# Altium schematic sheet DRIVER.SchDoc
size A4
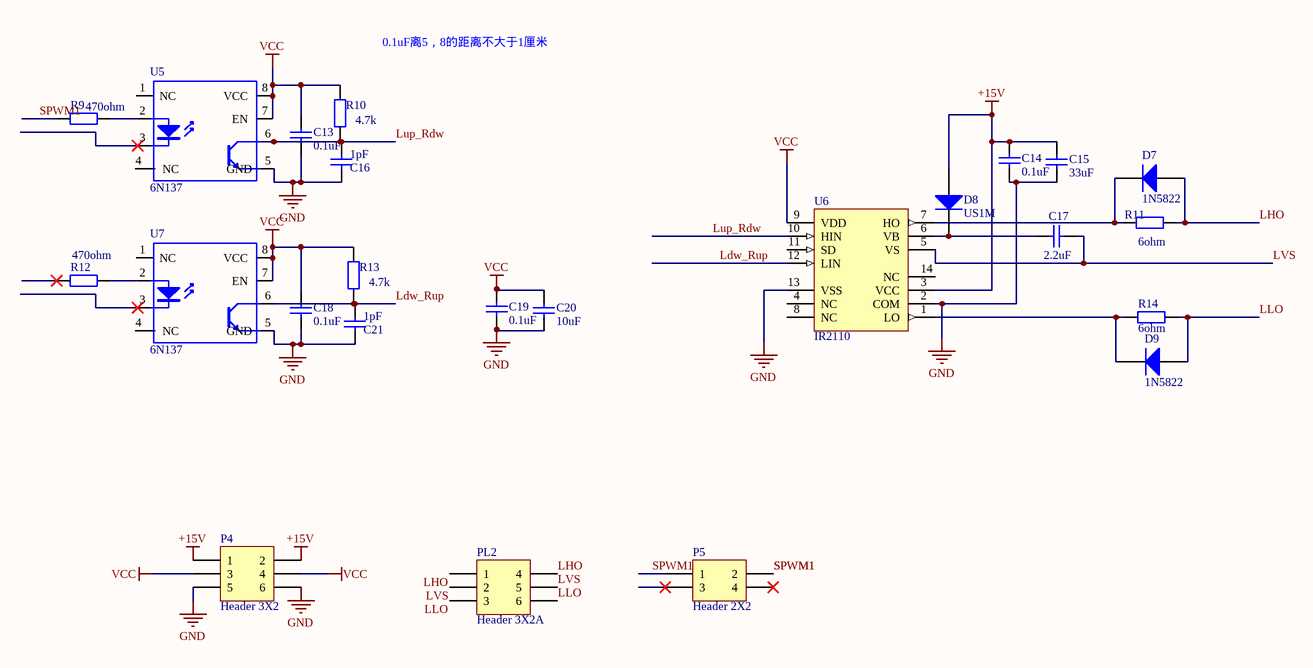
[diagram p0: DRIVER.SchDoc]

## Parts
C13  value 0.1uF  [1608[0603]]  (hidden comment: Cap)
C14  value 0.1uF  [1608[0603]]  (hidden comment: Cap)
C15  value 33uF  [C1210]  (hidden comment: Cap)
C16  value 1pF  [1608[0603]]  (hidden comment: Cap)
C17  value 2.2uF  [C1210]  (hidden comment: Cap)
C18  value 0.1uF  [1608[0603]]  (hidden comment: Cap)
C19  value 0.1uF  [1608[0603]]  (hidden comment: Cap)
C20  value 10uF  [C1210]  (hidden comment: Cap)
C21  value 1pF  [1608[0603]]  (hidden comment: Cap)
D7  1N5822  [DIODE-0.4]
D8  US1M  [DIOM5127X229N]
D9  1N5822  [DIODE-0.4]
P4  Header 3X2  [HDR2X3]
P5  Header 2X2  [HDR2X2]
PL2  Header 3X2A  [HDR2X3_CEN]
R9  value 470ohm  [1608[0603]]  (hidden comment: Res2)
R10  value 4.7k  [1608[0603]]  (hidden comment: Res2)
R11  value 6ohm  [0402]  (hidden comment: Res2)
R12  value 470ohm  [1608[0603]]  (hidden comment: Res2)
R13  value 4.7k  [1608[0603]]  (hidden comment: Res2)
R14  value 6ohm  [0402]  (hidden comment: Res2)
U5  6N137  [DIP-8]
U6  IR2110  [DIP-14]
U7  6N137  [DIP-8]

## Nets
+15V: C14.2 C15.1 D8.1(A) P4.1 P4.2 U6.3(VCC)
GND: C13.1 C14.1 C15.2 C16.1 C18.1 C19.1 C20.2 C21.1 P4.5 P4.6 U5.5(GND) U6.2(COM) U6.13(VSS) U7.5(GND)
VCC: C13.2 C18.2 C19.2 C20.1 P4.3 P4.4 R10.2 R13.2 U5.7(EN) U5.8(VCC) U6.9(VDD) U7.7(EN) U7.8(VCC)
Ldw_Rup: C21.2 R13.1 U6.12(LIN) U7.6(C)
LHO: D7.1(A) PL2.1 PL2.4 R11.2
LLO: D9.1(A) PL2.3 PL2.6 R14.2
Lup_Rdw: C16.2 R10.1 U5.6(C) U6.10(HIN)
LVS: C17.2 PL2.2 PL2.5 U6.5(VS)
SPWM1: P5.1 P5.2 R9.1
NetC17_1: C17.1 D8.2(K) U6.6(VB)
NetD7_2: D7.2(K) R11.1 U6.7(HO)
NetD9_2: D9.2(K) R14.1 U6.1(LO)
NetR9_2: R9.2 U5.2(A)
NetR12_2: R12.2 U7.2(A)

Not connected (* = marked no-connect by the designer): P5 3* 4*; R12 1*; U5 1(NC) 3(K)* 4(NC); U6 4(NC) 8(NC) 11(SD) 14(NC); U7 1(NC) 3(K)* 4(NC)

## Notes on the sheet
- (near R10) 0.1uF离5，8的距离不大于1厘米

## Library data of the parts
C13-C21 = Cap: Capacitor; Published: 8-Jun-2000; LatestRevisionDate: 17-Jul-2002; LatestRevisionNote: Re-released for DXP Platform.; PackageReference: RAD-0.3; Publisher: Altium Limited; PackageDescription: Radial Cap, Thru-Hole; 2 Leads; 0.3 in Pin Spacing
D7-D9 = 1N4148: High Conductance Fast Diode; Published: 8-Jun-2000; LatestRevisionDate: 17-Jul-2002; LatestRevisionNote: Re-released for DXP Platform.; DatasheetDocument: 1997; PackageReference: DO-35; Publisher: Altium Limited; Code_JEDEC: DO-204-AH; ComponentLink1Description: Manufacturer Link; ComponentLink1URL: http://www.fairchildsemi.com/; ComponentLink2Description: Datasheet; ComponentLink2URL: http://www.fairchildsemi.com/ds/1N%2F1N4148.pdf
P4 = Header 3X2: Header, 3-Pin, Dual row; LatestRevisionDate: 17-Jul-2002; LatestRevisionNote: Re-released for DXP Platform.; Publisher: Altium Limited
P5 = Header 2X2: Header, 2-Pin, Dual row; LatestRevisionDate: 17-Jul-2002; LatestRevisionNote: Re-released for DXP Platform.; Publisher: Altium Limited
PL2 = Header 3X2A: Header, 3-Pin, Dual row; LatestRevisionDate: 17-Jul-2002; LatestRevisionNote: Re-released for DXP Platform.; Publisher: Altium Limited
R9-R14 = Res2: Resistor; Published: 8-Jun-2000; LatestRevisionDate: 17-Jul-2002; LatestRevisionNote: Re-released for DXP Platform.; PackageReference: AXIAL-0.4; Publisher: Altium Limited; PackageDescription: Axial Device, Thru-Hole; 2 Leads; 0.4 in Pin Spacing
U6 = IR2110: High and Low Side Driver; Note: Pins 4, 8 and 14 are not connected; Published: 8-Jun-2000; LatestRevisionDate: 04-Mar-2005; LatestRevisionNote: Stylized 3D Model Added.; DatasheetVersion: PD60147J; PackageReference: PDIP14; Publisher: Altium Limited; PackageDescription: DIP; 14 Leads; Row Spacing 7.62 mm; Pitch 2.54 mm; ComponentLink1Description: Manufacturer Link; ComponentLink1URL: http://www.irf.com/; ComponentLink2Description: Datasheet; ComponentLink2URL: http://www.irf.com/product-info/datasheets/data/ir2110.pdf